# EAGLE design 1.3 (EAGLE 7.7.0)
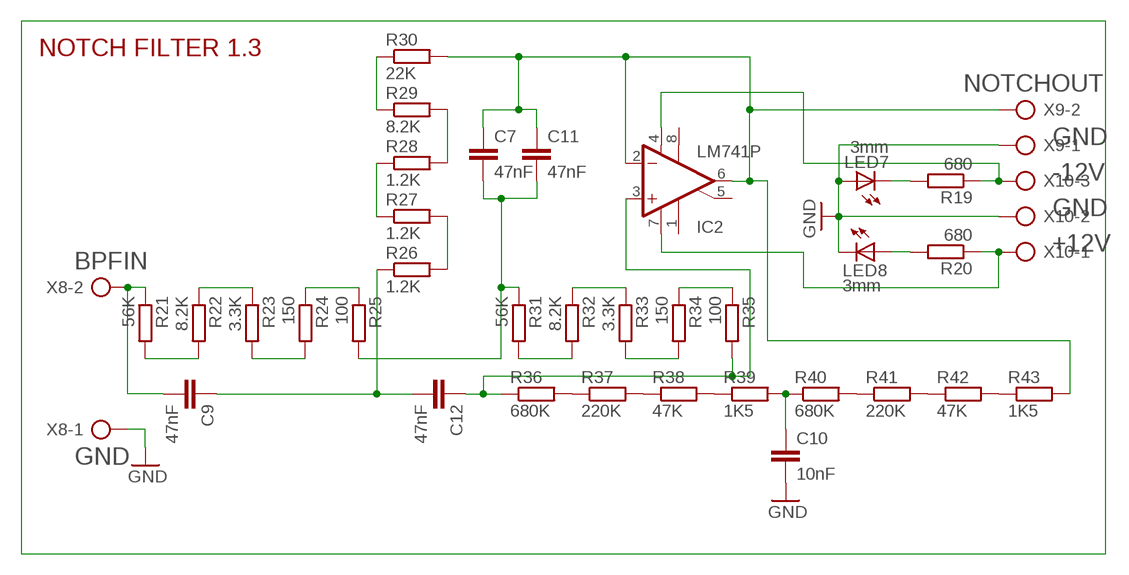
[diagram p0: schematic, sheet 1]

## Parts
C7  47nF  C-EU050-025X075  [C050-025X075]
C9  47nF  C-EU050-025X075  [C050-025X075]
C10  10nF  C-EU050-025X075  [C050-025X075]
C11  47nF  C-EU050-025X075  [C050-025X075]
C12  47nF  C-EU050-025X075  [C050-025X075]
IC2  LM741P  [DIL08]
LED7  3mm  LED5MM  [LED5MM]
LED8  3mm  LED5MM  [LED5MM]
R19  680  R-EU_0207/10  [0207/10]
R20  680  R-EU_0207/10  [0207/10]
R21  56K  R-EU_0207/10  [0207/10]
R22  8.2K  R-EU_0207/10  [0207/10]
R23  3.3K  R-EU_0207/10  [0207/10]
R24  150  R-EU_0207/10  [0207/10]
R25  100  R-EU_0207/10  [0207/10]
R26  1.2K  R-EU_0207/10  [0207/10]
R27  1.2K  R-EU_0207/10  [0207/10]
R28  1.2K  R-EU_0207/10  [0207/10]
R29  8.2K  R-EU_0207/10  [0207/10]
R30  22K  R-EU_0207/10  [0207/10]
R31  56K  R-EU_0207/10  [0207/10]
R32  8.2K  R-EU_0207/10  [0207/10]
R33  3.3K  R-EU_0207/10  [0207/10]
R34  150  R-EU_0207/10  [0207/10]
R35  100  R-EU_0207/10  [0207/10]
R36  680K  R-EU_0207/10  [0207/10]
R37  220K  R-EU_0207/10  [0207/10]
R38  47K  R-EU_0207/10  [0207/10]
R39  1K5  R-EU_0207/10  [0207/10]
R40  680K  R-EU_0207/10  [0207/10]
R41  220K  R-EU_0207/10  [0207/10]
R42  47K  R-EU_0207/10  [0207/10]
R43  1K5  R-EU_0207/10  [0207/10]
X8  AK500/2-H  [AK500/2-H]
X9  AK500/2-H  [AK500/2-H]
X10  AK500/3-H  [AK500/3-H]

## Nets
+12V: IC2.7(V+) R20.1 X10.1
-12V: IC2.4(V-) R19.1 X10.3
BPFIN: C9.2 R21.1 X8.2
GND: C10.2 LED7.A LED8.K(C) X8.1 X9.1 X10.2
N$20: R21.2 R22.2
N$21: R22.1 R23.1
N$22: R23.2 R24.2
N$31: R24.1 R25.1
N$32: R26.2 R27.2
N$33: R27.1 R28.1
N$34: R28.2 R29.2
N$35: R29.1 R30.1
N$38: C7.2 C11.2 R25.2 R31.1
N$40: R31.2 R32.2
N$41: R32.1 R33.1
N$42: R33.2 R34.2
N$43: R34.1 R35.1
N$45: C9.1 C12.2 R26.1
N$46: R36.2 R37.1
N$47: R37.2 R38.1
N$48: R38.2 R39.1
N$49: C10.1 R39.2 R40.1
N$50: R40.2 R41.1
N$51: R41.2 R42.1
N$52: R42.2 R43.1
N$56: C12.1 IC2.3(+IN) R35.2 R36.1
N$59: LED7.K(C) R19.2
N$60: LED8.A R20.2
NOTCHOUT: C7.1 C11.1 IC2.2(-IN) IC2.6(OUT) R30.2 R43.2 X9.2
Unconnected: IC2.1(ON1) IC2.5(ON2) IC2.8(OPT)

## Notes on the sheet
- NOTCH FILTER 1.3

## Library data of the parts
C7 C9-C12 = rcl:C-EU: CAPACITOR, European symbol
IC2 = linear:*741: OP AMP
LED7 LED8 = led:LED: LED OSRAM: - CHIPLED LG R971, LG N971, LY N971, LG Q971, LY Q971, LO R971, LY R971 LH N974, LH R974 LS Q976, LO Q976, LY Q976 LO Q996 - Hyper CHIPLED LW Q18S LB Q993, LB Q99A, LB R99A - SideLED LS A670, LO A670, LY A670, LG A670, LP A670 LB A673, LV A673, LT A673, LW A673 LH A674 LY A675 LS A676, LA A676, LO A676, LY A676, LW A676 LS A679, LY A679, LG A679 - Hyper Micro SIDELED® LS Y876, LA Y876, LO Y876, LY Y876 LT Y87S - SmartLED LW L88C, LW L88S LB L89C, LB L89S, LG L890 LS L89K, LO L89K, LY L89K LS L896, LA L896, LO L896, LY L896 - TOPLED LS T670, LO T670, LY T670, LG T670, LP T670 LSG T670, LSP T670, LSY T670, LOP T670, LYG T670 LG T671, LOG T671, LSG T671 LB T673, LV T673, LT T673, LW T673 LH T674 LS T676, LA T676, LO T676, LY T676, LB T676, LH T676, LSB T676, LW T676 LB T67C, LV T67C, LT T67C, LS T67K, LO T67K, LY T67K, LW E67C LS E67B, LA E67B, LO E67B, LY E67B, LB E67C, LV E67C, LT E67C LW T67C LS T679, LY T679, LG T679 LS T770, LO T770, LY T770, LG T770, LP T770 LB T773, LV T773, LT T773, LW T773 LH T774 LS E675, LA E675, LY E675, LS T675 LS T776, LA T776, LO T776, LY T776, LB T776 LHGB T686 LT T68C, LB T68C - Hyper Mini TOPLED® LB M676 - Mini TOPLED Santana® LG M470 LS M47K, LO M47K, LY M47K Source: http://www.osram.convergy.de LUXEON: - LUMILED® LXK2-PW12-R00, LXK2-PW12-S00, LXK2-PW14-U00, LXK2-PW14-V00 LXK2-PM12-R00, LXK2-PM12-S00, LXK2-PM14-U00 LXK2-PE12-Q00, LXK2-PE12-R00, LXK2-PE12-S00, LXK2-PE14-T00, LXK2-PE14-U00 LXK2-PB12-K00, LXK2-PB12-L00, LXK2-PB12-M00, LXK2-PB14-N00, LXK2-PB14-P00, LXK2-PB14-Q00 LXK2-PR12-L00, LXK2-PR12-M00, LXK2-PR14-Q00, LXK2-PR14-R00 LXK2-PD12-Q00, LXK2-PD12-R00, LXK2-PD12-S00 LXK2-PH12-R00, LXK2-PH12-S00 LXK2-PL12-P00, LXK2-PL12-Q00, LXK2-PL12-R00 Source: www.luxeon.com KINGBRIGHT: KA-3528ASYC Source: www.kingbright.com
R19-R43 = resistor:R-EU_: RESISTOR, European symbol
X8 X9 = con-ptr500:AK500/2-H: CONNECTOR Aug. 2004 / PTR Meßtechnik: Die Bezeichnung der Serie AK505 wurde geändert. Es handelt sich hierbei um AK500 in horizontaler Ausführung.; OC_FARNELL: unknown; OC_NEWARK: unknown
X10 = con-ptr500:AK500/3-H: CONNECTOR Aug. 2004 / PTR Meßtechnik: Die Bezeichnung der Serie AK505 wurde geändert. Es handelt sich hierbei um AK500 in horizontaler Ausführung.; OC_FARNELL: unknown; OC_NEWARK: unknown

## Board
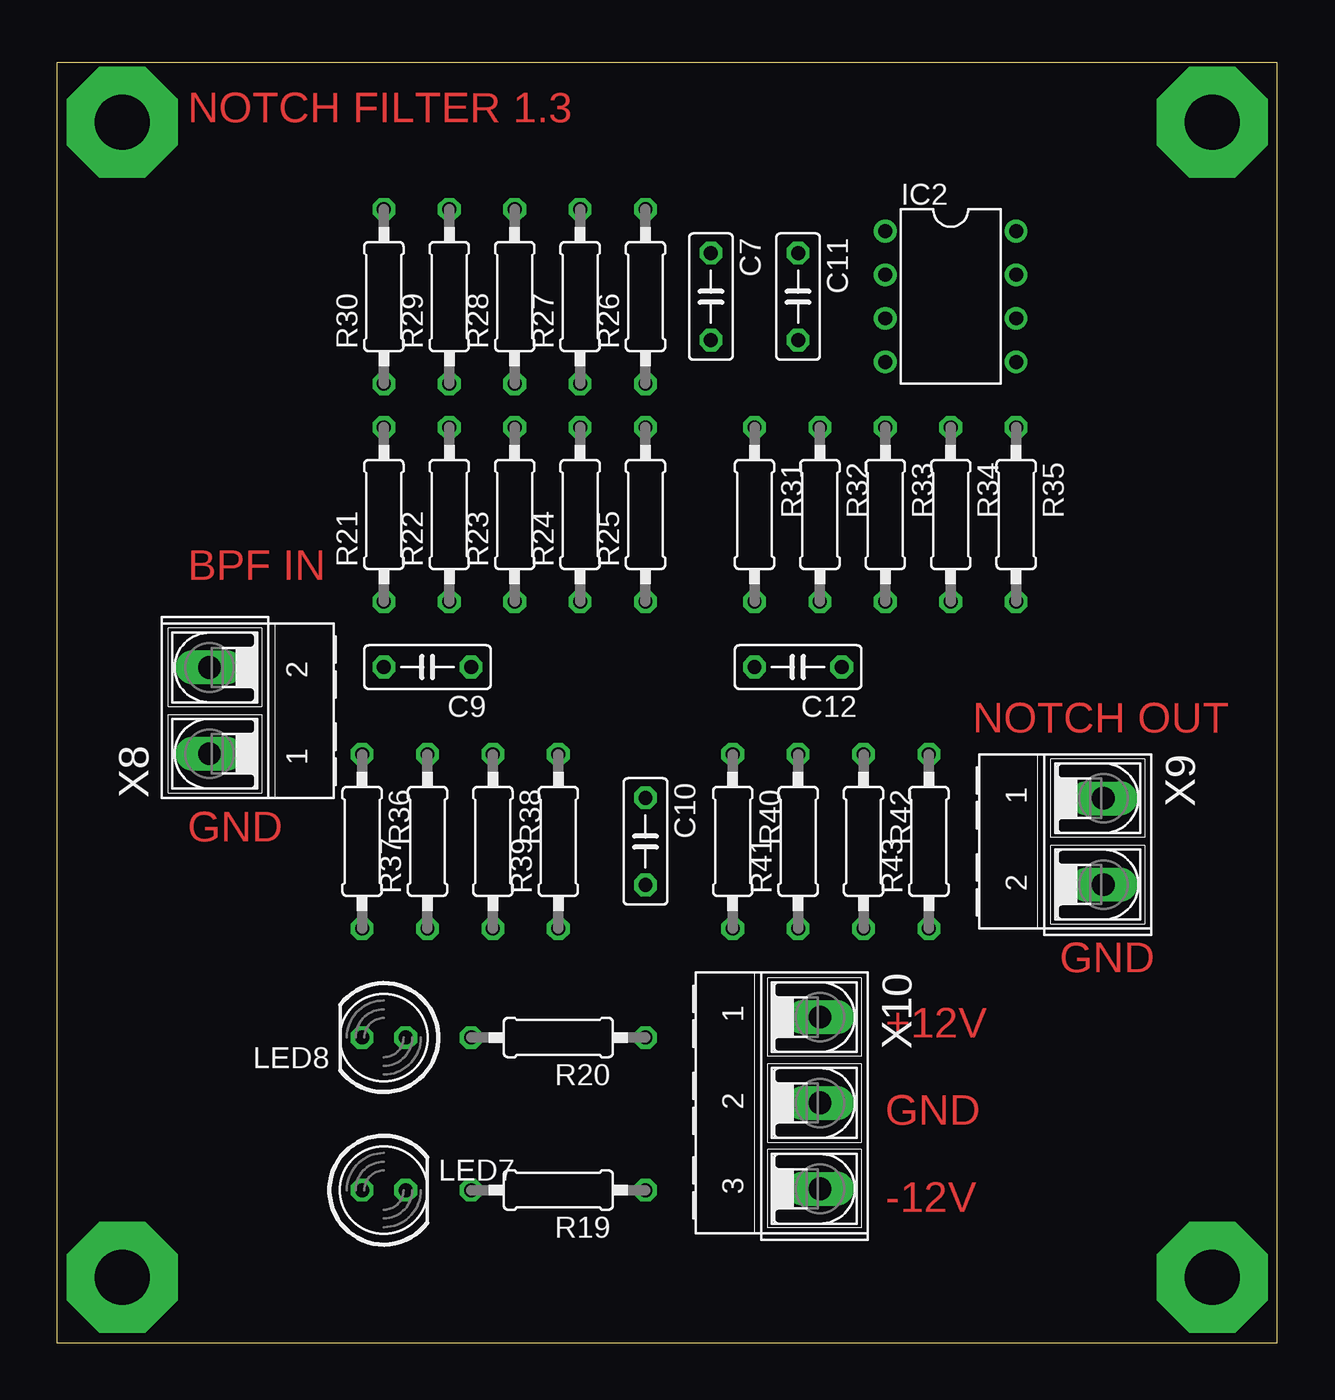
[diagram p1: board, top side]
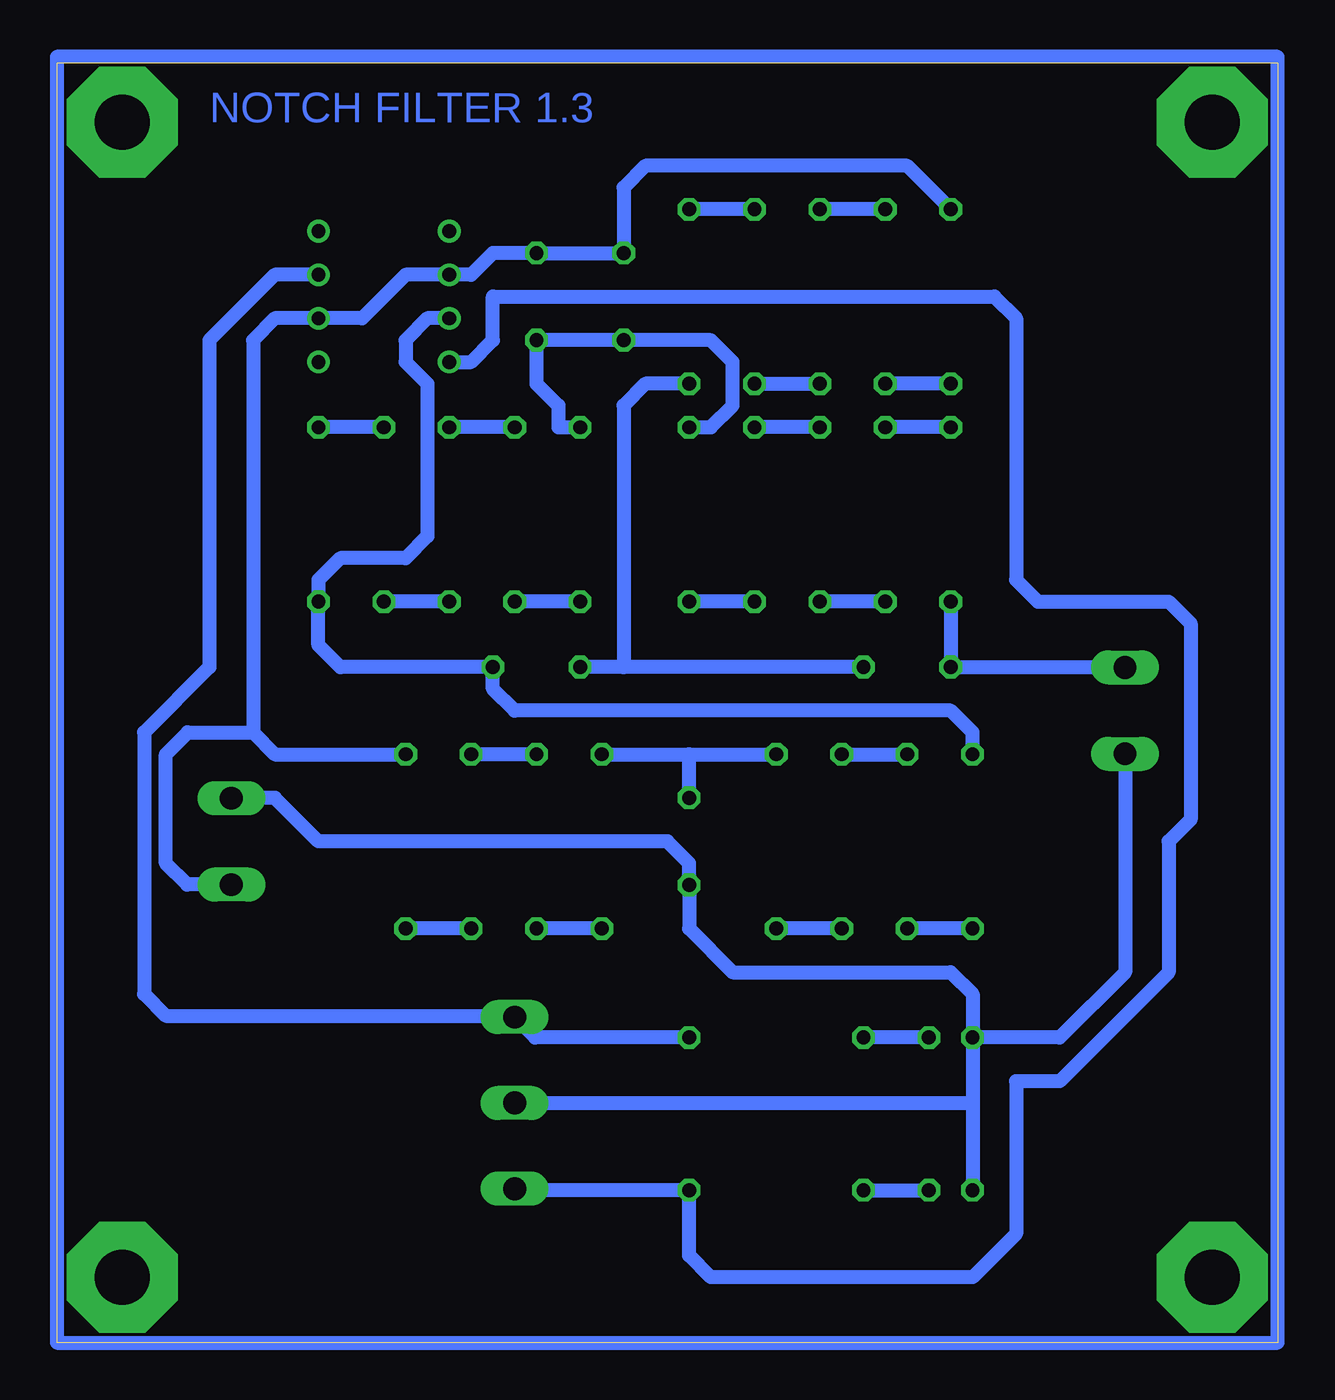
[diagram p2: board, bottom side, seen from below]

Size 71.1 x 74.6 mm. Coordinates in mm from the lower left corner, seen from the top.
Outline: 0,0 71.1,0 71.1,74.6 0,74.6 0,0
Copper layers (1*16): Top 0.035mm / dielectric 1.5mm / Bottom 0.035mm
Design rules "default": minimum track width 10mil, minimum drill 24mil, track to track 8mil, track to pad 8mil, pad to pad 8mil, via to via 8mil, smd to smd 8mil, copper to edge 40mil, drill to drill 8mil, minimum pad ring 10mil, minimum via ring 8mil, stop-mask expansion 4mil, vias tented up to drill 0mil, thermal gap 10mil

### Footprints (pad centres in the part's own frame; a part is rotated, then mirrored left to right if it is on the bottom)
C050-025X075 = drill 0.813 octagon: 1 -2.54,0; 2 2.54,0
DIL08 = drill 0.813 pad 1.27: 1 -3.81,-3.81; 2 -1.27,-3.81; 3 1.27,-3.81; 4 3.81,-3.81; 5 3.81,3.81; 6 1.27,3.81; 7 -1.27,3.81; 8 -3.81,3.81
LED5MM = drill 0.813 octagon: A -1.27,0; K 1.27,0
0207/10 = drill 0.813 octagon: 1 -5.08,0; 2 5.08,0
AK500/2-H = drill 1.321 long: 1 -2.515,0; 2 2.515,0
AK500/3-H = drill 1.321 long: 1 -5.004,0; 2 0,0; 3 5.004,0

### Placement (x,y rotation side)
C7  38.1,60.96 270 top
C9  21.59,39.37 180 top
C10  34.29,29.21 270 top
C11  43.18,60.96 270 top
C12  43.18,39.37 180 top
IC2  52.07,60.96 270 top
LED7  19.05,8.89 0 top
LED8  19.05,17.78 180 top
R19  29.21,8.89 180 top
R20  29.21,17.78 180 top
R21  19.05,48.26 90 top
R22  22.86,48.26 90 top
R23  26.67,48.26 90 top
R24  30.48,48.26 90 top
R25  34.29,48.26 90 top
R26  34.29,60.96 90 top
R27  30.48,60.96 90 top
R28  26.67,60.96 90 top
R29  22.86,60.96 90 top
R30  19.05,60.96 90 top
R31  40.64,48.26 270 top
R32  44.45,48.26 270 top
R33  48.26,48.26 270 top
R34  52.07,48.26 270 top
R35  55.88,48.26 270 top
R36  17.78,29.21 270 top
R37  21.59,29.21 90 top
R38  25.4,29.21 270 top
R39  29.21,29.21 90 top
R40  39.37,29.21 270 top
R41  43.18,29.21 90 top
R42  46.99,29.21 270 top
R43  50.8,29.21 90 top
X8  8.89,36.83 90 top
X9  60.96,29.21 270 top
X10  44.45,13.97 270 top

### Tracks (layer width: path | path; a pad name or v marks a point on that pad's centre or on a via)
+12V
  Bottom 0.813: R20.1 43.26,17.78 X10.1 44.53,19.05 64.77,19.05 66.04,20.32 66.04,35.56 62.23,39.37 62.23,58.42 58.42,62.23 IC2.7
-12V
  Bottom 0.813: X10.3 44.37,8.89 R19.1 34.29,5.08 33.02,3.81 17.78,3.81 15.24,6.35 15.24,15.24 12.7,15.24 6.35,21.59 6.35,29.21 5.08,30.48 5.08,41.91 6.35,43.18 13.97,43.18 15.24,44.45 15.24,59.69 16.51,60.96 45.72,60.96 45.72,58.42 46.99,57.15 IC2.4
BPFIN
  Bottom 0.813: X8.2 19.05,39.34 C9.2 R21.1
GND
  Bottom 0.813: LED8.K 17.78,13.97 | 17.78,13.97 LED7.A | X8.1 8.89,21.59 12.7,17.78 LED8.K | LED8.K 17.78,20.32 19.05,21.59 31.75,21.59 34.29,24.13 C10.2 34.29,27.94 35.56,29.21 55.88,29.21 58.42,31.75 60.94,31.75 X9.1 | X10.2 17.78,13.97
N$1
  Bottom 0.813: 0,74.93 71.12,74.93 71.12,0 0,0 0,74.93
N$2  (via drill 3.2 pad 6.45)
  other vias: 3.81,3.81
N$3  (via drill 3.2 pad 6.45)
  other vias: 67.31,3.81
N$4  (via drill 3.2 pad 6.45)
  other vias: 67.31,71.12
N$5  (via drill 3.2 pad 6.45)
  other vias: 3.81,71.12
N$20
  Bottom 0.813: R21.2 R22.2
N$21
  Bottom 0.813: R22.1 R23.1
N$22
  Bottom 0.813: R23.2 R24.2
N$31
  Bottom 0.813: R24.1 R25.1
N$32
  Bottom 0.813: R27.2 R26.2
N$33
  Bottom 0.813: R27.1 R28.1
N$34
  Bottom 0.813: R29.2 R28.2
N$35
  Bottom 0.813: R30.1 R29.1
N$38
  Bottom 0.813: R31.1 41.91,53.34 41.91,54.61 43.18,55.88 C11.2 C7.2 33.02,58.42 31.75,57.15 31.75,54.61 33.02,53.34 R25.2
N$40
  Bottom 0.813: R31.2 R32.2
N$41
  Bottom 0.813: R32.1 R33.1
N$42
  Bottom 0.813: R33.2 R34.2
N$43
  Bottom 0.813: R34.1 R35.1
N$45
  Bottom 0.813: C9.1 38.1,39.37 | 38.1,39.37 C12.2 | R26.1 36.83,55.88 38.1,54.61 38.1,39.37
N$46
  Bottom 0.813: R36.2 R37.1
N$47
  Bottom 0.813: R38.1 R37.2
N$48
  Bottom 0.813: R38.2 R39.1
N$49
  Bottom 0.813: R40.1 34.29,34.29 | 34.29,34.29 R39.2 | C10.1 34.29,34.29
N$50
  Bottom 0.813: R40.2 R41.1
N$51
  Bottom 0.813: R41.2 R42.1
N$52
  Bottom 0.813: R42.2 R43.1
N$56
  Bottom 0.813: R36.1 17.78,35.56 19.05,36.83 44.45,36.83 45.72,38.1 C12.1 54.61,39.37 55.88,40.64 R35.2 55.88,44.45 54.61,45.72 50.8,45.72 49.53,46.99 49.53,55.88 50.8,57.15 50.8,58.42 49.53,59.69 IC2.3
N$59
  Bottom 0.813: R19.2 LED7.K
N$60
  Bottom 0.813: LED8.A R20.2
NOTCHOUT
  Bottom 0.813: R30.2 21.59,68.58 36.83,68.58 38.1,67.31 C7.1 C11.1 45.72,63.5 46.99,62.23 IC2.2 50.8,62.23 53.34,59.69 IC2.6 58.42,59.69 59.69,58.42 59.69,35.56 | 59.69,35.56 58.42,34.29 R43.2 | X9.2 63.52,26.69 64.77,27.94 64.77,34.29 63.5,35.56 59.69,35.56

### Text on the board
Top: NOTCH FILTER 1.3 | BPF IN | NOTCH OUT | GND | GND | +12V | GND | -12V
Bottom: NOTCH FILTER 1.3